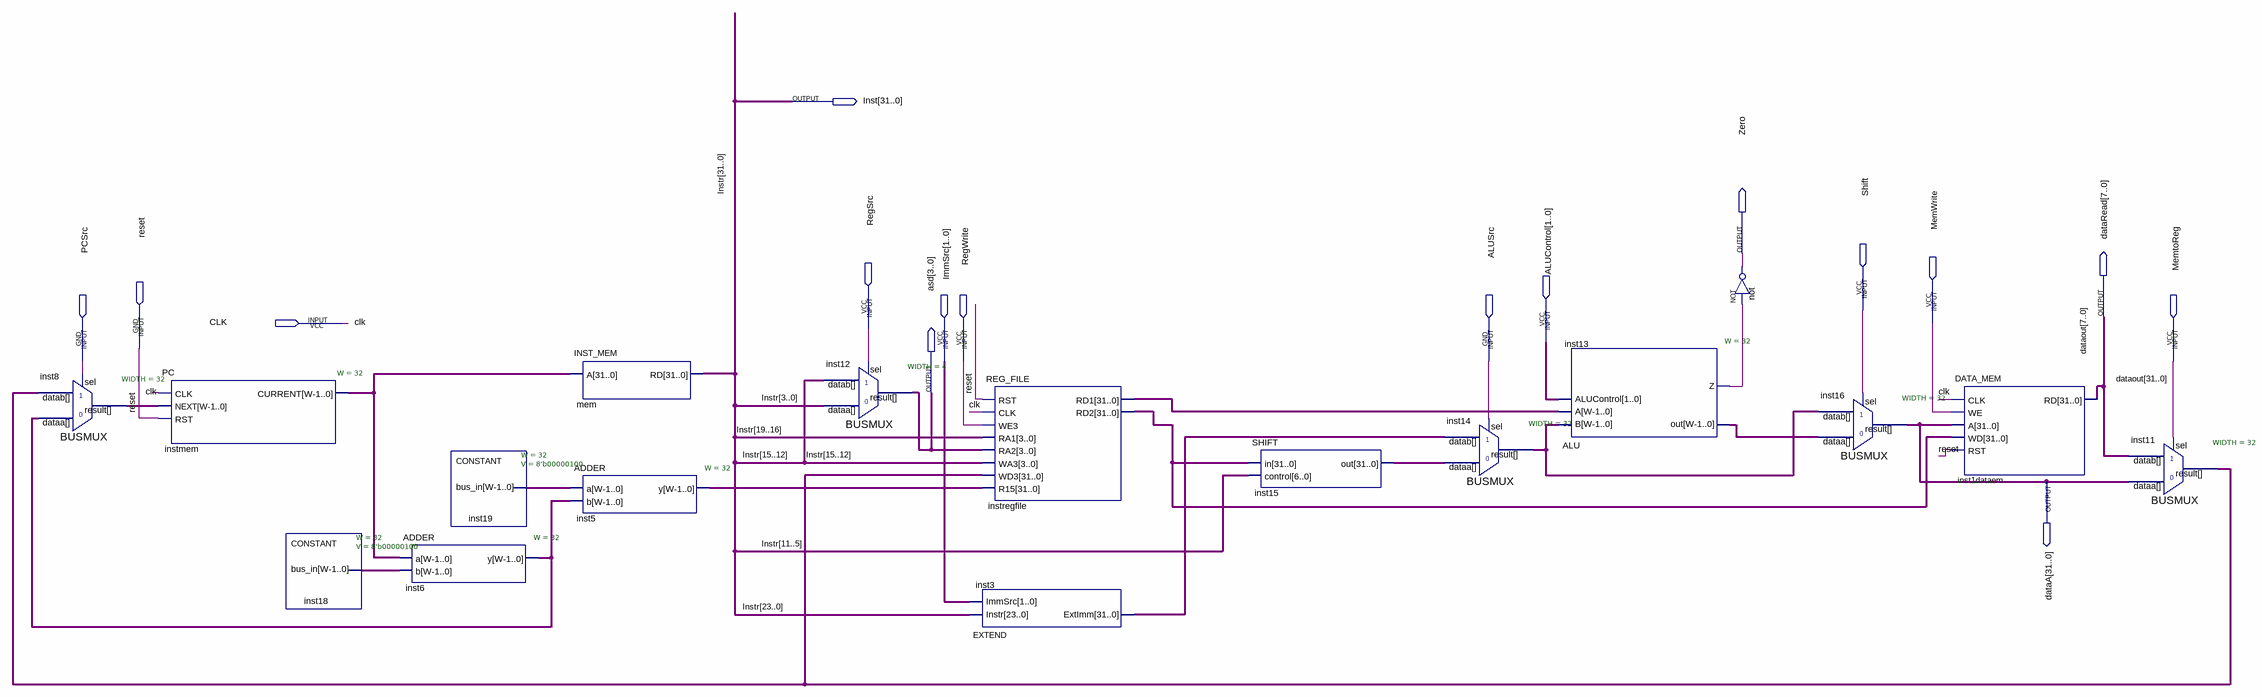
[diagram p0: schematic sheet]
// Quartus schematic datapath.bdf as structural Verilog: 17 symbols, 16 pins
module datapath (
  input  Shift,
  input  CLK,
  input  MemWrite,
  input  RegSrc,
  input  [1:0] ALUControl,
  input  reset,
  input  PCSrc,
  input  [1:0] ImmSrc,
  input  RegWrite,
  input  ALUSrc,
  input  MemtoReg,
  output [31:0] Inst,
  output Zero,
  output [7:0] dataRead,
  output [3:0] asd,
  output [31:0] dataA
);

  wire inst13_z;
  wire [31:0] inst3_extimm, inst5_y, inst6_y, inst8_result, inst11_result, inst13_out, inst14_result,
       inst15_out, inst18_bus_in, inst19_bus_in, instmem_current, instregfile_rd1, instregfile_rd2;
  wire [31:8] dataout;

  BUSMUX #(.WIDTH(32)) inst8 (.datab(inst11_result), .sel(PCSrc), .dataa(inst6_y), .result(inst8_result));
  PC #(.W(32)) instmem (.CLK(CLK), .NEXT(inst8_result), .RST(reset), .CURRENT(instmem_current));
  CONSTANT #(.W(32), .V(8'b00000100)) inst18 (.bus_in(inst18_bus_in));
  ADDER #(.W(32)) inst6 (.a(instmem_current), .b(inst18_bus_in), .y(inst6_y));
  CONSTANT #(.W(32), .V(8'b00000100)) inst19 (.bus_in(inst19_bus_in));
  INST_MEM mem (.A(instmem_current), .RD(Inst));
  ADDER #(.W(32)) inst5 (.a(inst19_bus_in), .b(inst6_y), .y(inst5_y));
  BUSMUX #(.WIDTH(4)) inst12 (.datab(Inst[15:12]), .sel(RegSrc), .dataa(Inst[3:0]), .result(asd));
  REG_FILE instregfile (
    .RST(reset), .CLK(CLK), .WE3(RegWrite), .RA1(Inst[19:16]), .RA2(asd), .WA3(Inst[15:12]),
    .WD3(inst11_result), .R15(inst5_y), .RD1(instregfile_rd1), .RD2(instregfile_rd2));
  EXTEND inst3 (.Instr(Inst[23:0]), .ImmSrc(ImmSrc), .ExtImm(inst3_extimm));
  SHIFT inst15 (.in(instregfile_rd2), .control(Inst[11:5]), .out(inst15_out));
  BUSMUX #(.WIDTH(32)) inst14 (.datab(inst3_extimm), .sel(ALUSrc), .dataa(inst15_out), .result(inst14_result));
  ALU #(.W(32)) inst13 (
    .ALUControl(ALUControl), .A(instregfile_rd1), .B(inst14_result), .Z(inst13_z), .out(inst13_out));
  not \not  (Zero, inst13_z);
  BUSMUX #(.WIDTH(32)) inst16 (.datab(inst14_result), .sel(Shift), .dataa(inst13_out), .result(dataA));
  DATA_MEM inst1dataem (
    .CLK(CLK), .WE(MemWrite), .A(dataA), .WD(instregfile_rd2), .RST(reset), .RD({dataout, dataRead}));
  BUSMUX #(.WIDTH(32)) inst11 (.datab({dataout, dataRead}), .sel(MemtoReg), .dataa(dataA), .result(inst11_result));

  // Other names for the same wires on the sheet: dataout[7:0] = dataRead; Instr[31:0] = Inst
endmodule
